# Altium schematic sheet PMU.SchDoc
size A
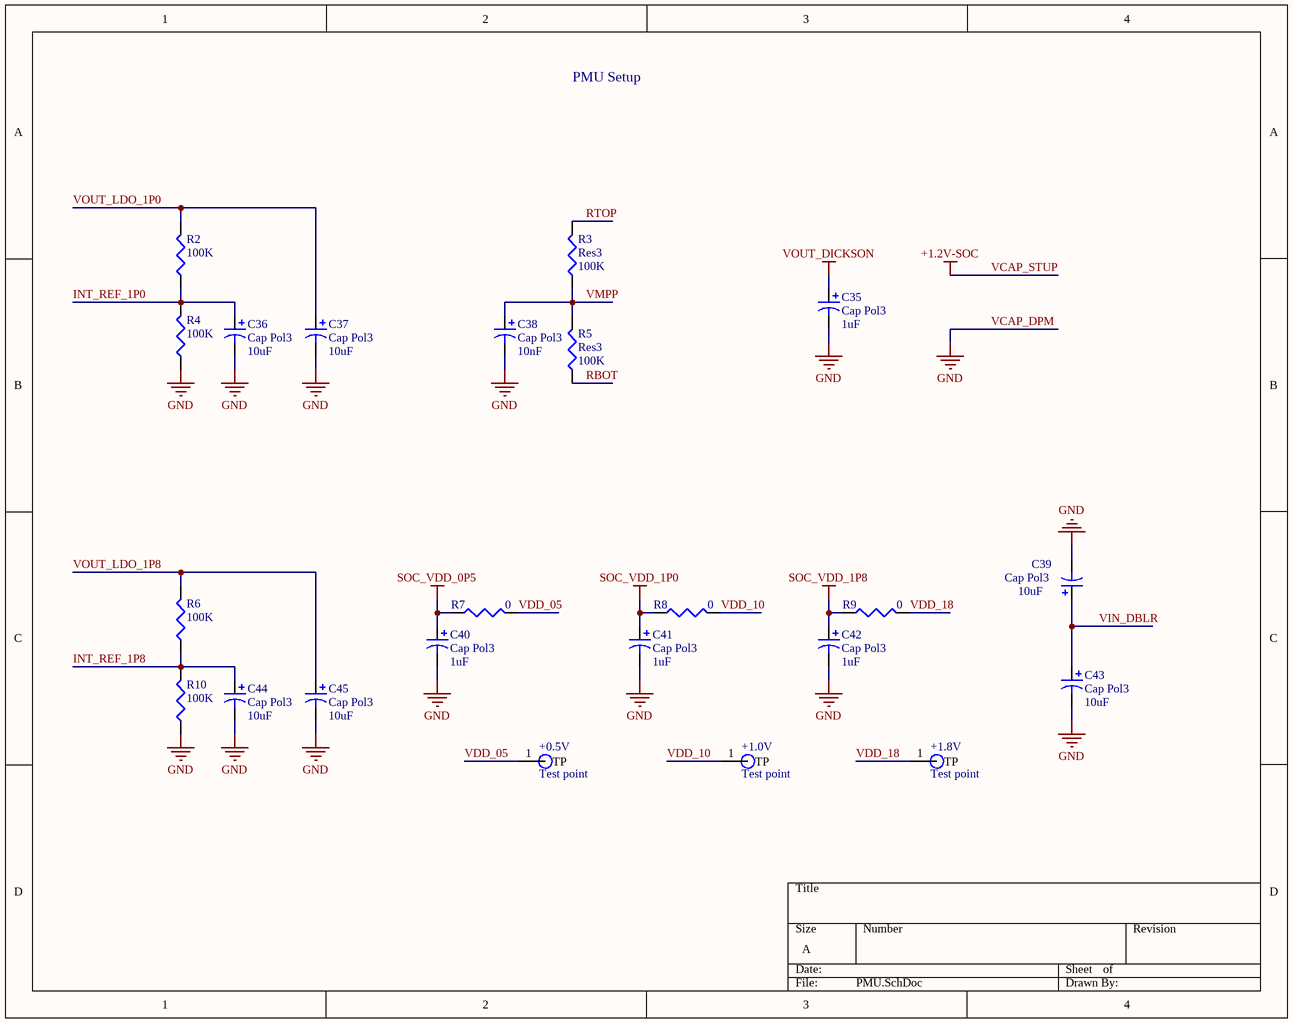
[diagram p0: PMU.SchDoc]

## Parts
+0.5V  Test point  [TP]
+1.0V  Test point  [TP]
+1.8V  Test point  [TP]
C35  Cap Pol3  value 1uF  [0402]
C36  Cap Pol3  value 10uF  [0402]
C37  Cap Pol3  value 10uF  [0402]
C38  Cap Pol3  value 10nF  [0402]
C39  Cap Pol3  value 10uF  [0402]
C40  Cap Pol3  value 1uF  [0402]
C41  Cap Pol3  value 1uF  [0402]
C42  Cap Pol3  value 1uF  [0402]
C43  Cap Pol3  value 10uF  [0402]
C44  Cap Pol3  value 10uF  [0402]
C45  Cap Pol3  value 10uF  [0402]
R2  value 100K  [0402]  (hidden comment: Res3)
R3  Res3  value 100K  [0402]
R4  value 100K  [0402]  (hidden comment: Res3)
R5  Res3  value 100K  [0402]
R6  value 100K  [0402]  (hidden comment: Res3)
R7  value 0  [0402]  (hidden comment: Res3)
R8  value 0  [0402]  (hidden comment: Res3)
R9  value 0  [0402]  (hidden comment: Res3)
R10  value 100K  [0402]  (hidden comment: Res3)

## Nets
SOC_VDD_0P5: C40.1 R7.1
SOC_VDD_1P0: C41.1 R8.1
SOC_VDD_1P8: C42.1 R9.1
VCAP_DPM: C35.2 C36.2 C37.2 C38.2 C39.2 C40.2 C41.2 C42.2 C43.2 C44.2 C45.2 R4.1 R10.1  [also labelled GND]
VOUT_DICKSON: C35.1
INT_REF_1P0: C36.1 R2.1 R4.2
INT_REF_1P8: C44.1 R6.1 R10.2
RBOT: R5.1
RTOP: R3.2
VDD_05: +0.5V.1(TP) R7.2
VDD_10: +1.0V.1(TP) R8.2
VDD_18: +1.8V.1(TP) R9.2
VIN_DBLR: C39.1 C43.1
VMPP: C38.1 R3.1 R5.2
VOUT_LDO_1P0: C37.1 R2.2
VOUT_LDO_1P8: C45.1 R6.2

## Notes on the sheet
- PMU Setup

## Library data of the parts
C35-C45 = Cap Pol3: Polarized Capacitor (Surface Mount); Published: 8-Jun-2000; LatestRevisionDate: 29-May-2009; LatestRevisionNote: IPC-7351 Footprint Added.; PackageReference: C0805; Publisher: Altium Limited; PackageDescription: Chip Capacitor
R2-R10 = Res3: Resistor; Published: 8-Jun-2000; LatestRevisionDate: 29-May-2009; LatestRevisionNote: IPC-7351 Footprint Added.; PackageReference: J1-0603; Publisher: Altium Limited; PackageDescription: Chip Resistor